# EasyEDA schematic SCH_2026_BSPD_V2_2026-09-22.json
TITLE: Sheet_1; REV: 1.0; Date: 2026-06-29; Sheet: 1/1; Drawn By: giwong88; Company: Your Company
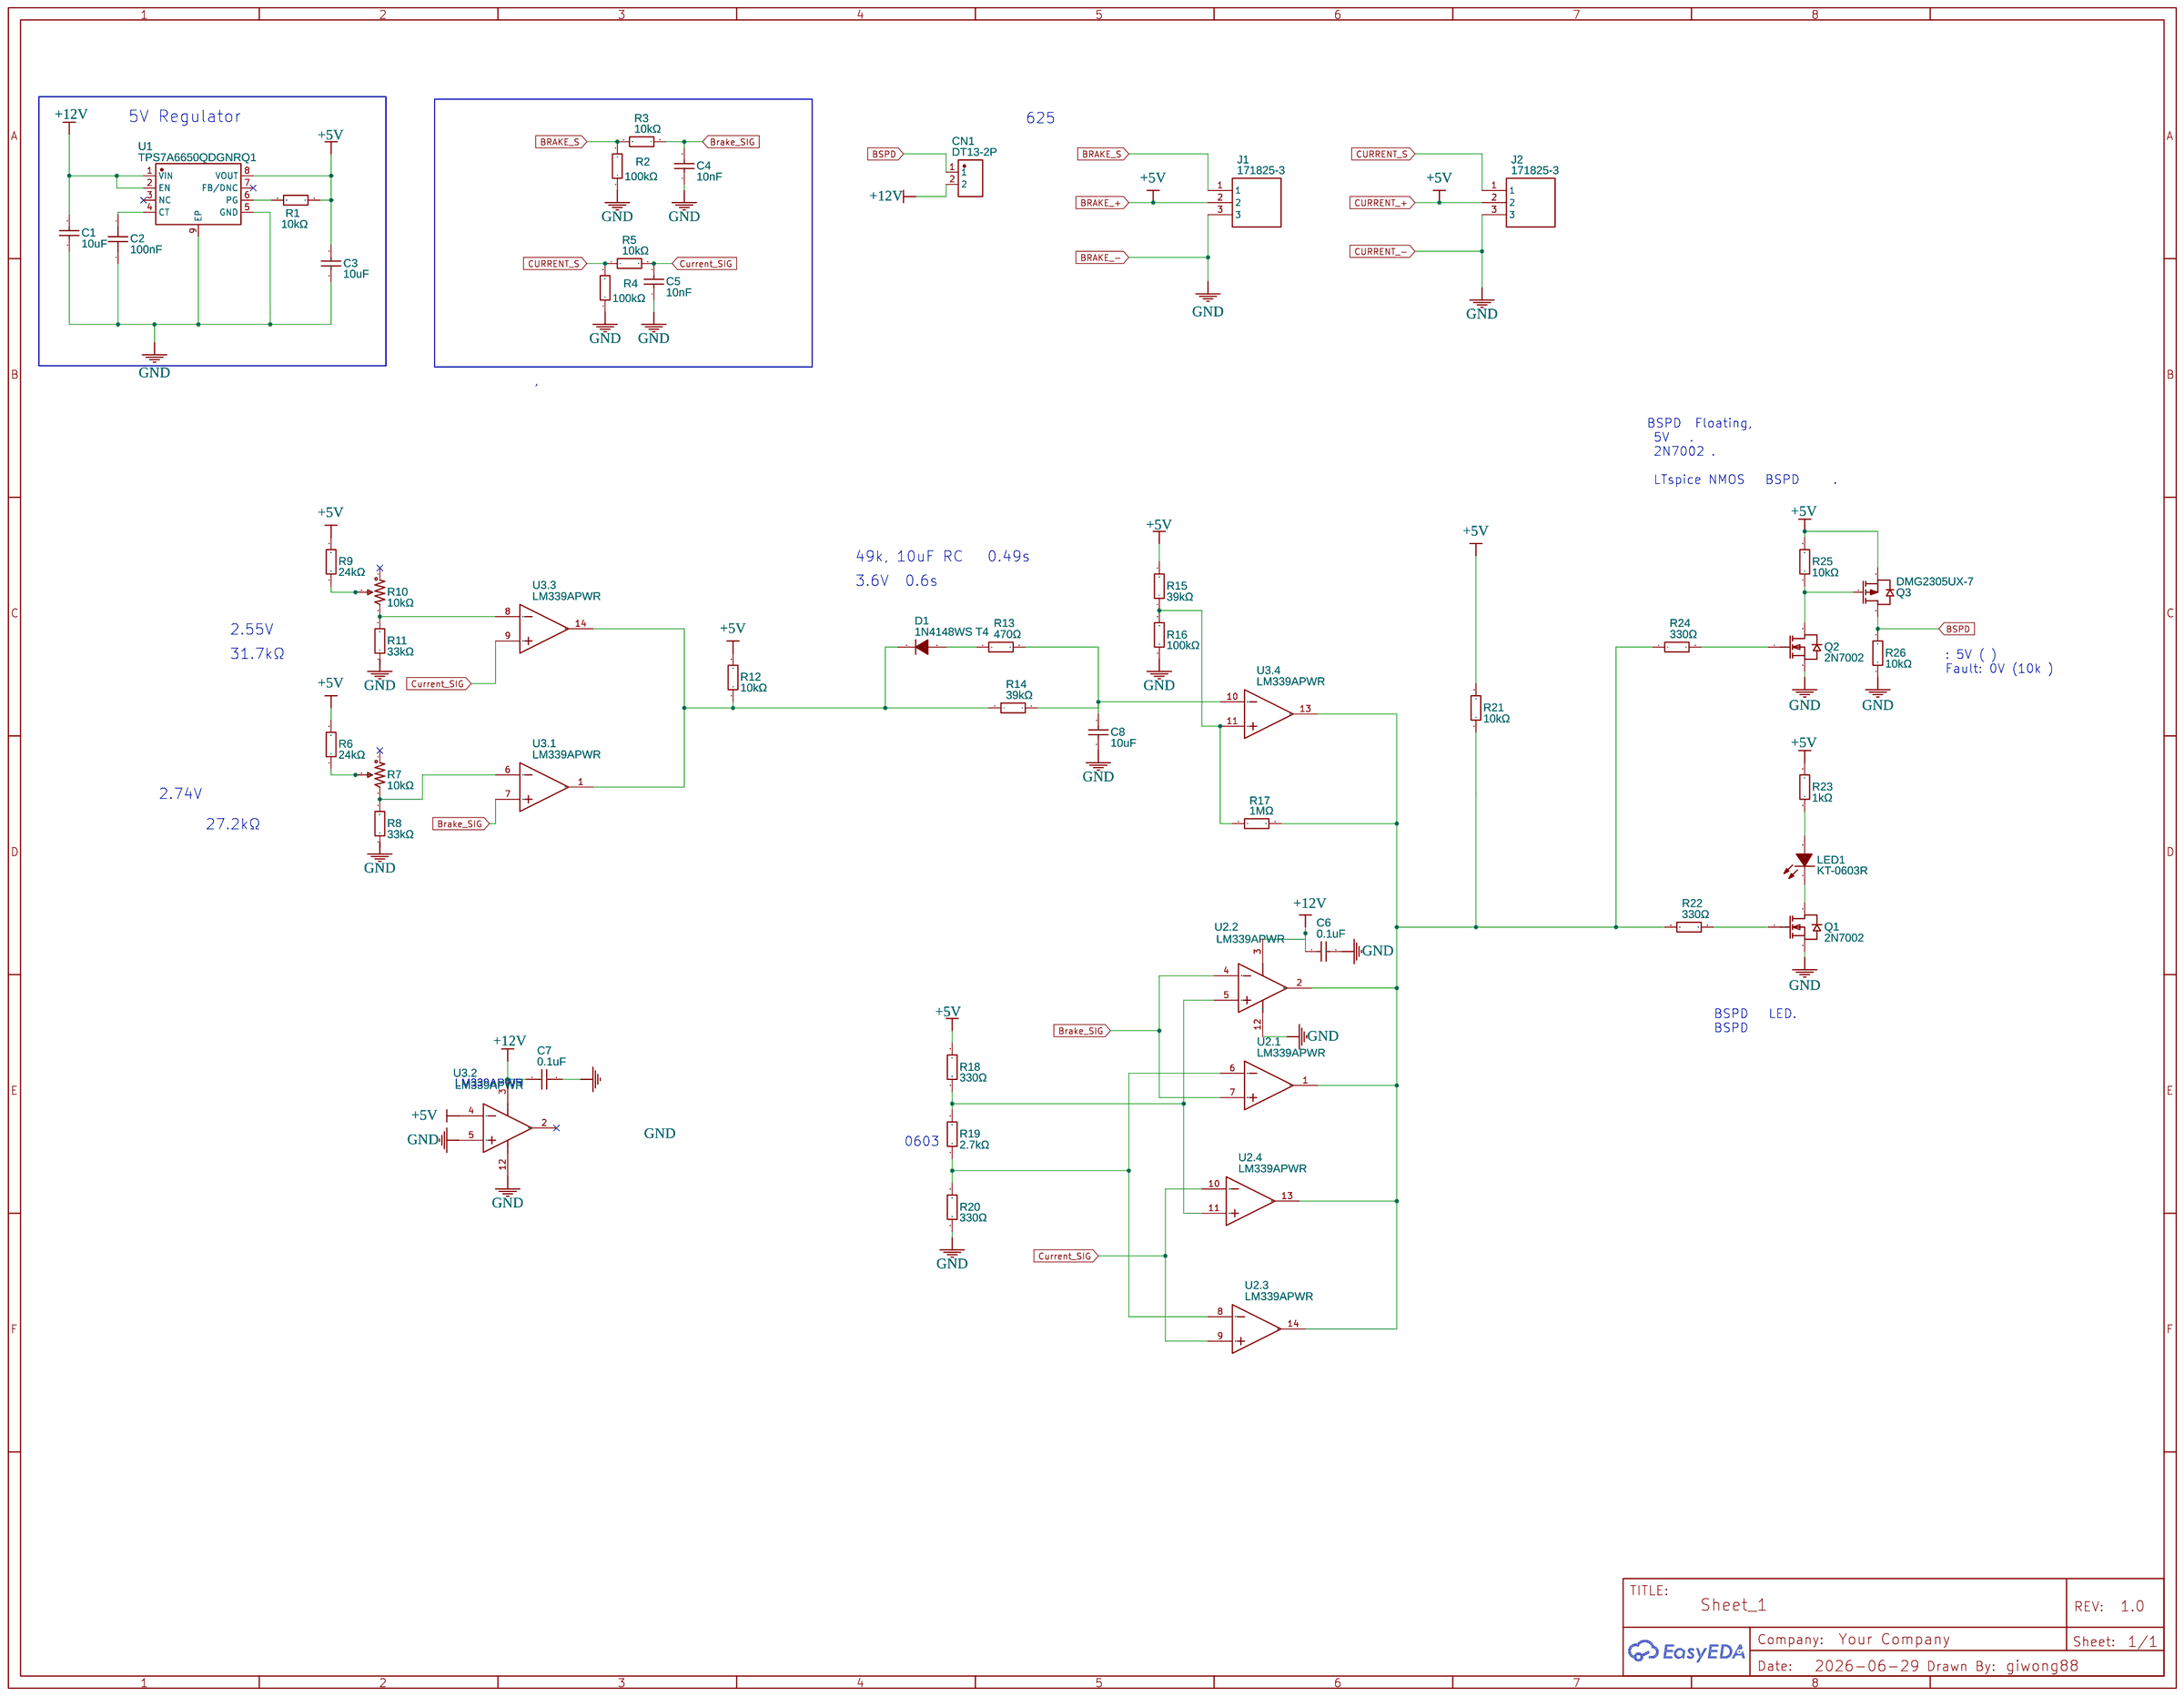
[diagram p0: schematic sheet]

## Parts
C1  10uF  [C1206]
C2  100nF  [C0402]
C3  10uF  [C1206]
C4  10nF  [C0805]
C5  10nF  [C0805]
C6  0.1uF  [C0603]
C7  0.1uF  [C0603]
C8  10uF  [C1206]
CN1  DT13-2P  [CONN-TH_DT13-2P]
D1  1N4148WS T4  [SOD-323_L1.8-W1.3-LS2.5-RD]
J1  171825-3  [SHDR3W69P0X250_1X3_750X490X1070P]
J2  171825-3  [SHDR3W69P0X250_1X3_750X490X1070P]
LED1  KT-0603R  [LED0603-RD]
Q1  2N7002  [SOT-23-3_L2.9-W1.3-P1.90-LS2.4-BR]
Q2  2N7002  [SOT-23-3_L2.9-W1.3-P1.90-LS2.4-BR]
Q3  DMG2305UX-7  [SOT-23-3_L2.9-W1.3-P1.90-LS2.4-BR]
R1  10kΩ  [R0603]
R2  100kΩ  [R0603]
R3  10kΩ  [R0805]
R4  100kΩ  [R0603]
R5  10kΩ  [R0805]
R6  24kΩ  [R0603]
R7  10kΩ  [RES-ADJ-SMD_3P-L3.0-W3.8-P1.75-BR]
R8  33kΩ  [R0805]
R9  24kΩ  [R0603]
R10  10kΩ  [RES-ADJ-SMD_3P-L3.0-W3.8-P1.75-BR]
R11  33kΩ  [R0805]
R12  10kΩ  [R0805]
R13  470Ω  [R0805]
R14  39kΩ  [R0603]
R15  39kΩ  [R0603]
R16  100kΩ  [R0603]
R17  1MΩ  [R0402]
R18  330Ω  [R0402]
R19  2.7kΩ  [R0603]
R20  330Ω  [R0402]
R21  10kΩ  [R0805]
R22  330Ω  [R0805]
R23  1kΩ  [R0402]
R24  330Ω  [R0805]
R25  10kΩ  [R0805]
R26  10kΩ  [R0805]
U1  TPS7A6650QDGNRQ1  [HVSSOP-8_L3.0-W3.0-P0.65-LS4.9-BL-EP1.8]
U2  LM339APWR  [TSSOP-14_L5.0-W4.4-P0.65-LS6.4-BL]  (sections 1,2,3,4)
U3  LM339APWR  [TSSOP-14_L5.0-W4.4-P0.65-LS6.4-BL]  (sections 1,2,3,4)

## Library data of the parts
C1 C3 C8 = CL31A106KBHNNNE: Supplier: LCSC; Manufacturer: SAMSUNG(三星); Supplier Part: C13585; JLCPCB Part Class: Basic Part
C2 = CL05B104KB54PNC: Contributor: LCSC; Supplier: LCSC; Supplier Part: C307331; Manufacturer: SAMSUNG(三星); JLCPCB Part Class: Basic Part
C4 C5 = CL21B103KBANNNC: Supplier: LCSC; Manufacturer: SAMSUNG(三星); Supplier Part: C1710; JLCPCB Part Class: Basic Part
C6 C7 = CL10A225KO8NNNC: Supplier: LCSC; Manufacturer: SAMSUNG(三星); Supplier Part: C23630; JLCPCB Part Class: Basic Part
CN1 = DT13-2P: Supplier: LCSC; Supplier Part: C17604590; Manufacturer: TE Connectivity(泰科电子); Contributor: lcsc; JLCPCB Part Class: Extended Part
D1 = 1N4148WS T4: Supplier: LCSC; Manufacturer: CJ(江苏长电/长晶); Manufacturer Part: 1N4148WS; Supplier Part: C2128; JLCPCB Part Class: Basic Part
J1 J2 = 171825-3
LED1 = KT-0603R: Supplier: LCSC; Manufacturer: KENTO; Supplier Part: C2286; JLCPCB Part Class: Basic Part
Q1 Q2 = 2N7002: Supplier: LCSC; Manufacturer: CJ(江苏长电/长晶); Supplier Part: C8545; JLCPCB Part Class: Basic Part
Q3 = DMG2305UX-7: Contributor: LCSC; Supplier: LCSC; Supplier Part: C150470; Manufacturer: DIODES(美台); JLCPCB Part Class: Extended Part
R1 = 0603WAF1002T5E: Supplier: LCSC; Manufacturer: UNI-ROYAL(厚声); Supplier Part: C25804; JLCPCB Part Class: Basic Part
R2 R4 R16 = 0603WAF1003T5E: Supplier: LCSC; Manufacturer: UNI-ROYAL(厚声); Supplier Part: C25803; JLCPCB Part Class: Basic Part
R3 R5 R12 R21 R25 R26 = 0805W8F1002T5E: Supplier: LCSC; Manufacturer: UNI-ROYAL(厚声); Supplier Part: C17414; JLCPCB Part Class: Basic Part
R6 R9 = 0603WAF2402T5E: Supplier: LCSC; Manufacturer: UNI-ROYAL(厚声); Supplier Part: C23352; JLCPCB Part Class: Basic Part
R7 R10 = TC33X-2-103E: Contributor: LCSC; Supplier: LCSC; Supplier Part: C719176; Manufacturer: BOURNS; JLCPCB Part Class: Extended Part
R8 R11 = 0805W8F3302T5E: Supplier: LCSC; Manufacturer: UNI-ROYAL(厚声); Supplier Part: C17633; JLCPCB Part Class: Basic Part
R13 = 0805W8F4700T5E: Supplier: LCSC; Manufacturer: UNI-ROYAL(厚声); Supplier Part: C17710; JLCPCB Part Class: Basic Part
R14 R15 = 0603WAF3902T5E: Supplier: LCSC; Manufacturer: UNI-ROYAL(厚声); Supplier Part: C23153; JLCPCB Part Class: Basic Part
R17 = 0402WGF1004TCE: Supplier: LCSC; Manufacturer: UNI-ROYAL(厚声); Supplier Part: C26083; JLCPCB Part Class: Basic Part
R18 R20 = 0402WGF3300TCE: Supplier: LCSC; Manufacturer: UNI-ROYAL(厚声); Supplier Part: C25104; JLCPCB Part Class: Basic Part
R19 = 0603WAF2701T5E: Supplier: LCSC; Manufacturer: UNI-ROYAL(厚声); Supplier Part: C13167; JLCPCB Part Class: Basic Part
R22 R24 = 0805W8F3300T5E: Supplier: LCSC; Manufacturer: UNI-ROYAL(厚声); Supplier Part: C17630; JLCPCB Part Class: Basic Part
R23 = 0402WGF1001TCE: Supplier: LCSC; Manufacturer: UNI-ROYAL(厚声); Supplier Part: C11702; JLCPCB Part Class: Basic Part
U1 = TPS7A6650QDGNRQ1: Contributor: LCSC; Supplier: LCSC; Supplier Part: C560964; Manufacturer: TI(德州仪器); JLCPCB Part Class: Extended Part
U2 U3 = LM339APWR: subpart_no: 1; Supplier: LCSC; Supplier Part: C167117; Manufacturer: TI(德州仪器); JLCPCB Part Class: Extended Part

## Nets
+5V: C3.2 J1.2 J2.2 Q3.2(S) R1.1 R6.2 R9.2 R12.2 R15.2 R18.2 R21.2 R23.2 R25.2 U1.8(VOUT) U3.4(IN1-)
+12V: C1.2 C6.2 C7.2 CN1.2 U1.1(VIN) U1.2(EN) U2.3(V+) U3.3(V+)
BRAKE_-: C1.1 C2.1 C3.1 C4.1 C5.1 C6.1 C7.1 C8.1 J1.3 J2.3 Q1.2(S) Q2.2(S) R2.1 R4.1 R8.1 R11.1 R16.1 R20.1 R26.1 U1.5(GND) U1.9(EP) U2.12(GND) U3.5(IN1+) U3.12(GND)
BRAKE_S: J1.1 R2.2 R3.1
Brake_SIG: C4.2 R3.2 U2.4(IN1-) U2.7(IN2+) U3.7(IN2+)
BSPD: CN1.1 Q3.3(D) R26.2
CURRENT_S: J2.1 R4.2 R5.1
Current_SIG: C5.2 R5.2 U2.9(IN3+) U2.10(IN4-) U3.9(IN3+)
Net-(C2-2): C2.2 U1.4(CT)
Net-(C8-2): C8.2 R13.2 R14.2 U3.10(IN4-)
Net-(D1-1): D1.1(K) R12.1 R14.1 U3.1(OUT2) U3.14(OUT3)
Net-(D1-2): D1.2(A) R13.1
Net-(LED1-1): LED1.1(K) Q1.3(D)
Net-(LED1-2): LED1.2(A) R23.1
Net-(Q1-1): Q1.1(G) R22.2
Net-(Q2-1): Q2.1(G) R24.2
Net-(Q2-3): Q2.3(D) Q3.1(G) R25.1
Net-(R1-2): R1.2 U1.6(PG)
Net-(R6-1): R6.1 R7.2
Net-(R7-3): R7.3 R8.2 U3.6(IN2-)
Net-(R9-1): R9.1 R10.2
Net-(R10-3): R10.3 R11.2 U3.8(IN3-)
Net-(R15-1): R15.1 R16.2 R17.1 U3.11(IN4+)
Net-(R17-2): R17.2 R21.1 R22.1 R24.1 U2.1(OUT2) U2.2(OUT1) U2.13(OUT4) U2.14(OUT3) U3.13(OUT4)
Net-(R18-1): R18.1 R19.2 U2.5(IN1+) U2.11(IN4+)
Net-(R19-1): R19.1 R20.2 U2.6(IN2-) U2.8(IN3-)

Not connected (* = marked no-connect by the designer): R7 1*; R10 1*; U1 3(NC)* 7(FB/DNC)*; U3 2(OUT1)*

## Notes on the sheet
- 5V Regulator
- 6월25일 작업일지
- 세모 위
- 정면에서
  세모 오른쪽
- 전류값이 너무 튀는 상황 방지, 풀다운
- BSPD상황이 발생하면 Floating,
  풀리면 5V를 출력하도록 한 회로.
  인버팅을 2N7002로 구현함.
  오른쪽에 LTspice로 NMOS 입력에 따른 BSPD 출력 잘 나오는 것을 확인함.
- 49k옴, 10uF RC 회로 시상수 0.49s
- 3.6V 도달하는데에 0.6s 소요
- 전류센서 2.55V
- 위에가 31.7kΩ 되도록
- 정상: 5V (저항 없이)
  Fault시: 0V (10k옴 직렬)
- 브레이크 유압센서 2.74V
- 위에가 27.2kΩ 되도록
- BSPD가 풀업되면 켜지는 LED.
  BSPD상황이 발생하면 꺼진다
- LM339APWR
- 0603임
